# EAGLE board bmsf3 (EAGLE 4.13), part 1 of 2
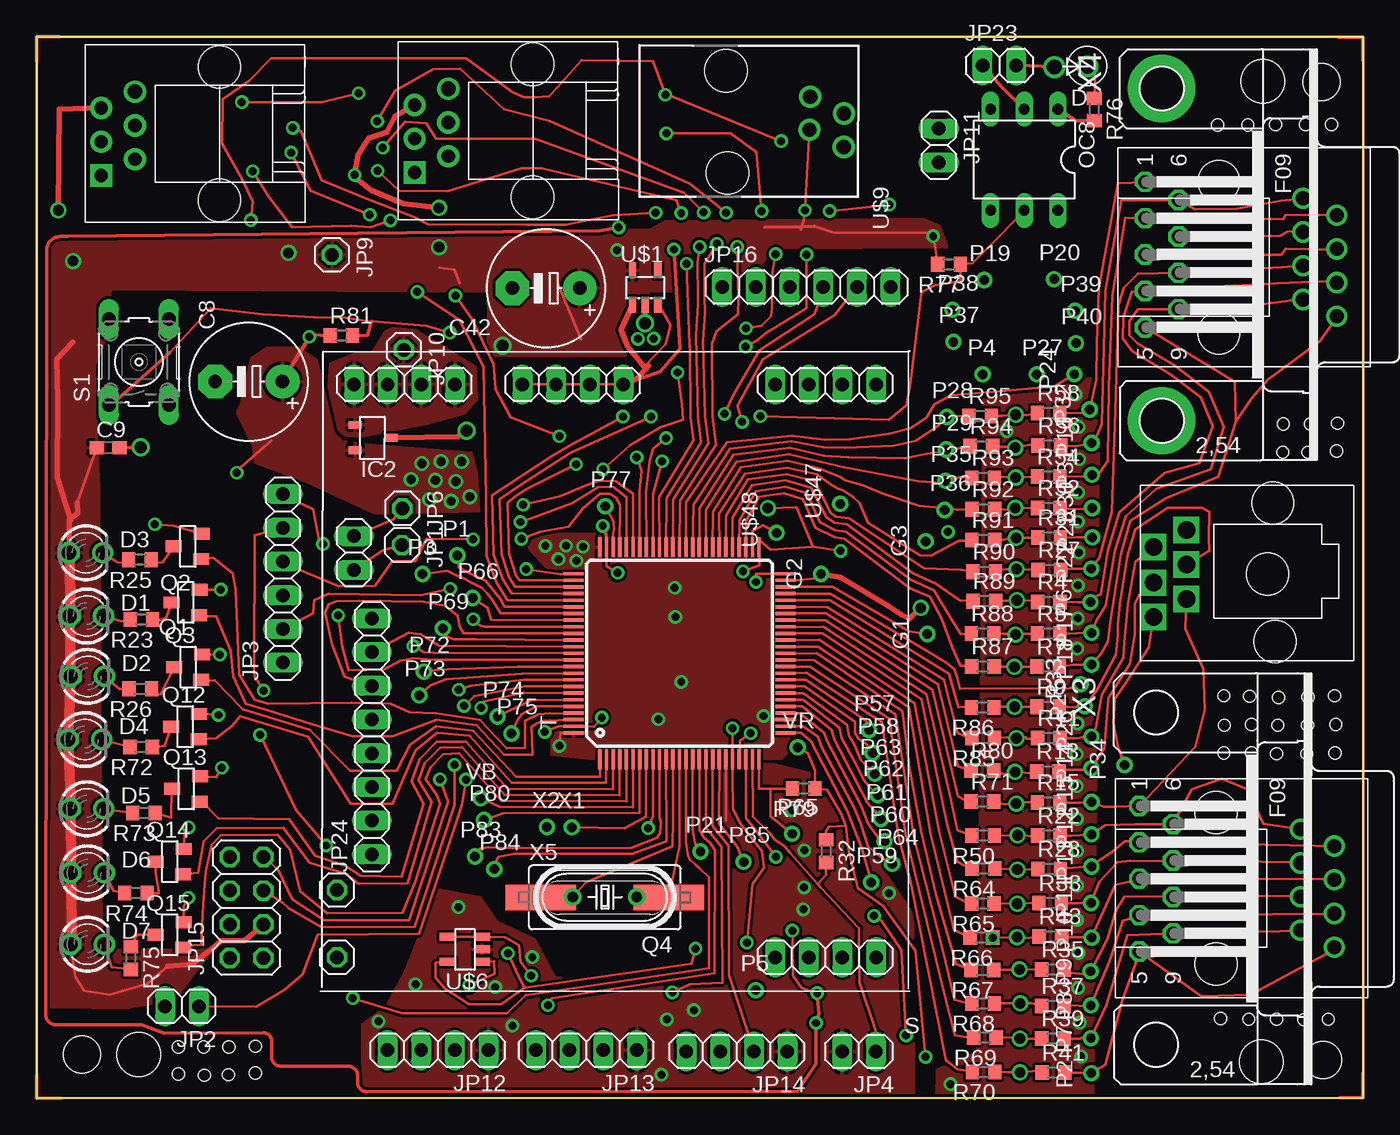
[diagram p2: board, top side]
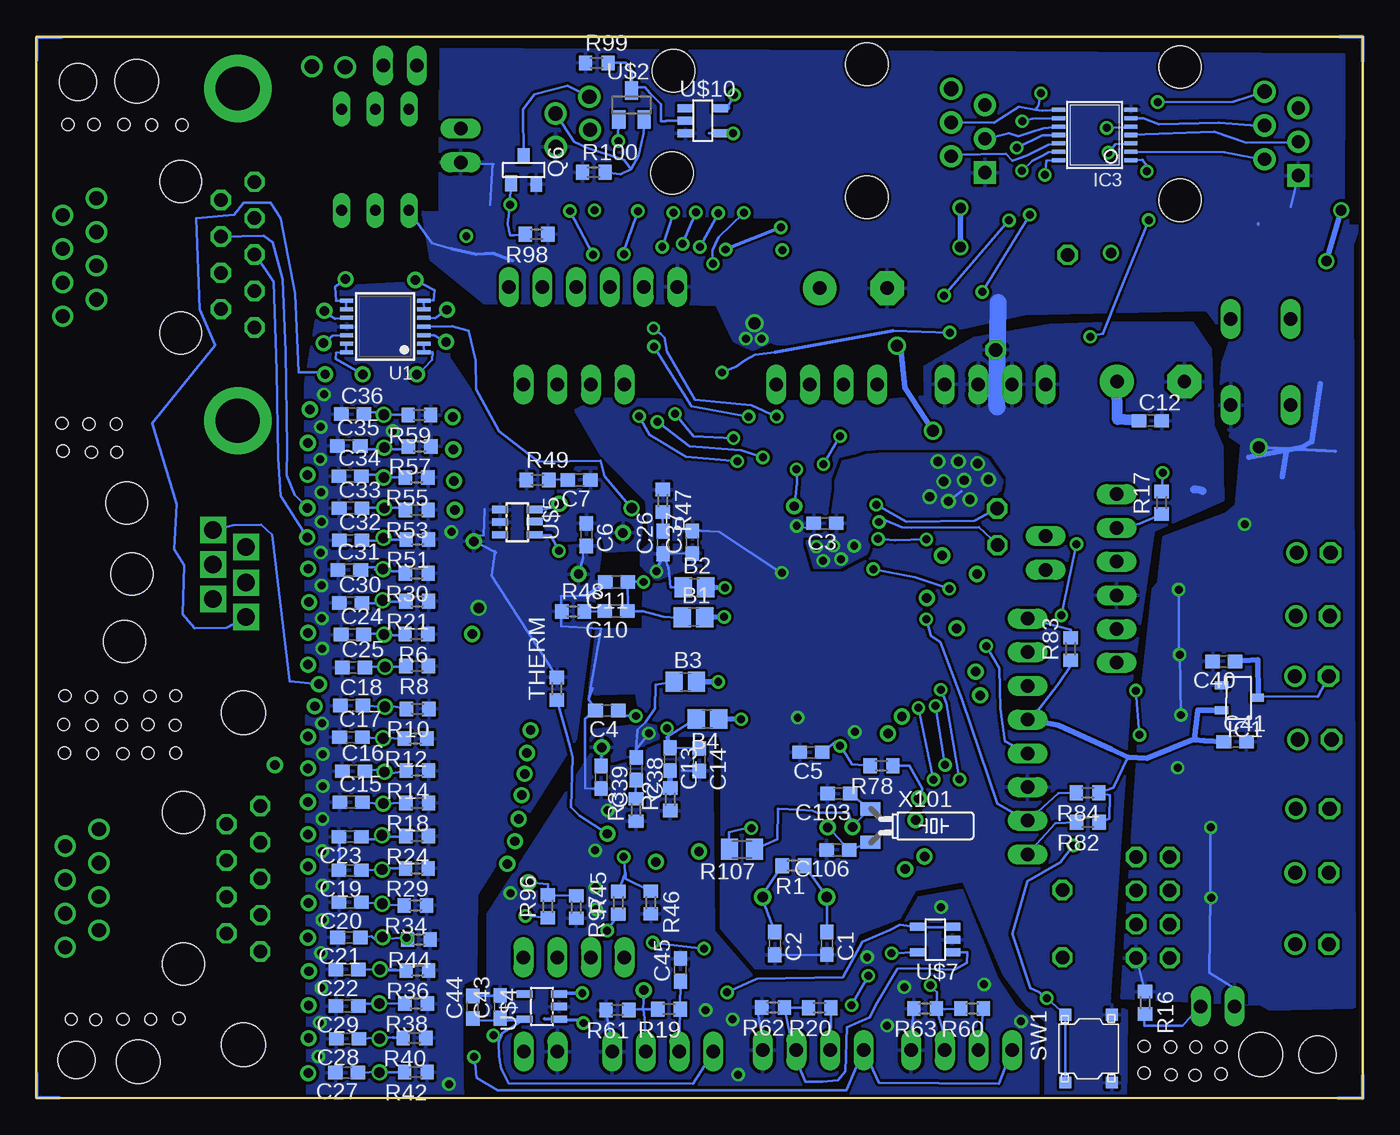
[diagram p3: board, bottom side, seen from below]

Size 100.02 x 80 mm. Coordinates in mm from the lower left corner, seen from the top.
Outline: 99.97,79.98 0.01,80 0,0 100,0.01
Outline: 100.02,79.97 100.02,0.03
Copper layers (1*16): Top 0.035mm / dielectric 1.5mm / Bottom 0.035mm
Design rules "default": minimum track width 8mil, minimum drill 0.6mm, track to track 0.2083mm, track to pad 8mil, pad to pad 8mil, via to via 8mil, smd to smd 0mil, copper to edge 8mil, drill to drill 8mil, minimum pad ring 10mil, minimum via ring 8mil, stop-mask expansion 4mil, vias tented up to drill 0mil, thermal gap 10mil
Holes 2.8 mm at 96.89,76.57 97,2.87 3.43,3.3
Holes 3.2 mm at 92.81,39.5
Holes 3.3 mm at 92.47,76.64 92.34,2.75 7.69,3.29
Holes 0.9 mm at 89.03,73.34 91.31,73.34 93.41,73.38 95.67,73.38 97.62,73.38 89.28,5.99 91.41,5.94 93.5,5.94 95.53,5.9 97.39,5.94 89.5,26.01 91.59,26.01 93.5,25.96 95.78,25.96 97.91,26.01 89.55,28.1 91.59,28.15 93.58,28.1 95.81,28.1 97.95,28.15 89.5,30.33 91.45,30.28 93.64,30.19 95.86,30.24 97.86,30.33 98.09,50.86 96.06,50.81 94,50.81 93.97,48.67 95.86,48.67 98,48.77 16.5,1.9 16.5,3.9 14.51,3.85 12.6,3.85 14.46,1.76 12.65,1.72 10.7,3.85 10.7,1.81

## Footprints (pad centres in the part's own frame; a part is rotated, then mirrored left to right if it is on the bottom)
C0805 = smd 1.3 x 1.5: 1 -0.85,0; 2 0.85,0
C0603 = smd 1.1 x 1: 1 -0.85,0; 2 0.85,0
E5-8,5 = drill 1.016 pad 2.54 round: + -2.54,0 | drill 1.016 pad 2.54 octagon: - 2.54,0
DO41-10_VERT = drill 1.1 round: A 2.58,0.05; C 0.07,0
LED3 = drill 1.067 pad 1.6 octagon: A -1.27,0 | drill 1.067 pad 1.6 round: K 1.27,0
SOLPAD028 = drill 0.711 pad 1.016 round: MP 0,0
SOT-23A = smd 0.6 x 1: P$1 -0.95,-1.35; P$2 0.95,-1.35; P$3 0,1.35
TSSOP14 = smd 0.305 x 0.991: 1 -1.905,-2.718; 2 -1.27,-2.718; 3 -0.635,-2.718; 4 0,-2.718; 5 0.635,-2.718; 6 1.27,-2.718; 7 1.905,-2.718; 8 1.905,2.718; 9 1.27,2.718; 10 0.635,2.718; 11 0,2.718; 12 -0.635,2.718; 13 -1.27,2.718; 14 -1.905,2.718
1X01 = drill 1.016 octagon: 1 0,0
1X02 = drill 1.016 long: 1 -1.27,0; 2 1.27,0
1X06 = drill 1.016 long: 1 -6.35,0; 2 -3.81,0; 3 -1.27,0; 4 1.27,0; 5 3.81,0; 6 6.35,0
MOD8P8C = drill 1.067 pad 1.397 round: 1 -3.81,-2.54; 2 -2.54,0; 3 -1.27,-2.54; 4 0,0; 5 1.27,-2.54; 6 2.54,0; 7 3.81,-2.54; 8 5.08,0 | hole 3.175: -5.08,-8.89; 6.35,-8.89
1X04 = drill 1.016 long: 1 -3.81,0; 2 -1.27,0; 3 1.27,0; 4 3.81,0
2X04 = drill 1.016 octagon: 1 -3.81,-1.27; 2 -3.81,1.27; 3 -1.27,-1.27; 4 -1.27,1.27; 5 1.27,-1.27; 6 1.27,1.27; 7 3.81,-1.27; 8 3.81,1.27
1X08 = drill 1.016 long: 1 -8.89,0; 2 -6.35,0; 3 -3.81,0; 4 -1.27,0; 5 1.27,0; 6 3.81,0; 7 6.35,0; 8 8.89,0
MOD6P6C_VERT = drill 1.321 pad 1.778 square: 1 -2.694,0; 2 -1.324,-2.486; 3 -0.1,0; 4 1.27,-2.486; 5 2.594,0; 6 3.864,-2.486 | hole 3.175: -4.537,-9.154; 5.907,-9
DIL06 = drill 0.813 long: 1 -2.54,-3.81; 2 0,-3.81; 3 2.54,-3.81; 4 2.54,3.81; 5 0,3.81; 6 -2.54,3.81
SOT-23 = smd 0.9 x 1.2: 1 -1,-1.006; 2 0.9,-1.056; 3 -0.05,1.056
HC49U-V = drill 0.8 round: 1 -2.413,0; 2 2.413,0
R0603 = smd 1 x 1.1: 1 -0.85,0; 2 0.85,0
M0805 = smd 1.3 x 1.6: 1 -0.95,0; 2 0.95,0
SUBBRD1B = drill 1.016 long: 1 2.54,2.54; 2 5.08,2.54; 3 7.62,2.54; 4 10.16,2.54; 5 21.59,2.54; 6 24.13,2.54; 7 26.67,2.54; 8 29.21,2.54; 9 34.29,2.54; 10 36.83,2.54; 11 39.37,2.54; 12 41.91,2.54; 13 2.54,45.72; 14 5.08,45.72; 15 7.62,45.72; 16 10.16,45.72; 17 41.91,13.97; 18 41.91,16.51 | drill 1.016 octagon: 19 43.18,45.72; 20 43.18,40.64
B3F-10XX = drill 1.016 long: 1 -3.251,2.261; 2 3.251,2.261; 3 -3.251,-2.261; 4 3.251,-2.261
E-SWITCH = smd 0.9 x 0.9: P$1 -2.55,1.75; P$2 2.55,1.75; P$3 -2.55,-1.75; P$4 2.55,-1.75
TQFP100_NARROW = smd 1.5 x 0.25: 1 -8,6; 2 -8,5.5; 3 -8,5; 4 -8,4.5; 5 -8,4; 6 -8,3.5; 7 -8,3; 8 -8,2.5; 9 -8,2; 10 -8,1.5; 11 -8,1; 12 -8,0.5; 13 -8,0; 14 -8,-0.5; 15 -8,-1; 16 -8,-1.5; 17 -8,-2; 18 -8,-2.5; 19 -8,-3; 20 -8,-3.5; 21 -8,-4; 22 -8,-4.5; 23 -8,-5; 24 -8,-5.5; 25 -8,-6; 51 8,-6; 52 8,-5.5; 53 8,-5; 54 8,-4.5; 55 8,-4; 56 8,-3.5; 57 8,-3; 58 8,-2.5; 59 8,-2; 60 8,-1.5; 61 8,-1; 62 8,-0.5; 63 8,0; 64 8,0.5; 65 8,1; 66 8,1.5; 67 8,2; 68 8,2.5; 69 8,3; 70 8,3.5; 71 8,4; 72 8,4.5; 73 8,5; 74 8,5.5; 75 8,6 | smd 0.25 x 1.5: 26 -6,-8; 27 -5.5,-8; 28 -5,-8; 29 -4.5,-8; 30 -4,-8; 31 -3.5,-8; 32 -3,-8; 33 -2.5,-8; 34 -2,-8; 35 -1.5,-8; 36 -1,-8; 37 -0.5,-8; 38 0,-8; 39 0.5,-8; 40 1,-8; 41 1.5,-8; 42 2,-8; 43 2.5,-8; 44 3,-8; 45 3.5,-8; 46 4,-8; 47 4.5,-8; 48 5,-8; 49 5.5,-8; 50 6,-8; 76 6,8; 77 5.5,8; 78 5,8; 79 4.5,8; 80 4,8; 81 3.5,8; 82 3,8; 83 2.5,8; 84 2,8; 85 1.5,8; 86 1,8; 87 0.5,8; 88 0,8; 89 -0.5,8; 90 -1,8; 91 -1.5,8; 92 -2,8; 93 -2.5,8; 94 -3,8; 95 -3.5,8; 96 -4,8; 97 -4.5,8; 98 -5,8; 99 -5.5,8; 100 -6,8
TSSOP14' = smd 0.305 x 0.991: 1 -1.95,-2.918; 2 -1.3,-2.918; 3 -0.65,-2.918; 4 0,-2.918; 5 0.65,-2.918; 6 1.3,-2.918; 7 1.95,-2.918; 8 1.95,2.918; 9 1.3,2.918; 10 0.65,2.918; 11 0,2.918; 12 -0.65,2.918; 13 -1.3,2.918; 14 -1.95,2.918
SOT-25 = smd 0.55 x 1.2: 1 -0.95,-1.3; 2 0,-1.3; 3 0.95,-1.3; 4 0.95,1.3; 5 -0.95,1.3
SOT23 = smd 1 x 1.4: 1 -0.95,-1.1; 2 0.95,-1.1; 3 0,1.1
SOT23-6 = smd 0.55 x 1.2: 1 -0.95,-1.3; 2 0,-1.3; 3 0.95,-1.3; 4 0.95,1.3; 5 -0.05,1.3; 6 -0.95,1.3
SOT23-5 = smd 0.6 x 1.2: 1 -0.95,-1.306; 2 0,-1.306; 3 0.95,-1.306; 4 0.95,1.306; 5 -0.95,1.306
MOD6P6C_1 = drill 1 pad 1.676 square: 1 -3.175,8.898 | drill 1 pad 1.676 round: 2 -1.951,6.358; 3 -0.627,8.898; 4 0.597,6.358; 5 1.921,8.898 | drill 1.1 pad 1.676 round: 6 3.145,6.358 | hole 3.2: -5.029,-0.01; 4.999,-0.01
MOD4P4C_VERT = drill 1.067 pad 1.676 round: 1 1.89,8.86; 2 0.59,6.28; 3 -0.63,8.88; 4 -1.89,6.33 | hole 3.2: -3.85,-0.01; 3.86,0.1
SOT-23' = smd 0.6 x 1.2: 1 -0.95,-1.306; 2 0,-1.306; 3 0.95,-1.306; 4 0.95,1.306; 5 -0.95,1.306
F09H = drill 1.016 octagon: 1 -5.486,-1.27; 2 -2.743,-1.27; 3 0,-1.27; 4 2.743,-1.27; 5 5.486,-1.27; 6 -4.115,1.27; 7 -1.372,1.27; 8 1.372,1.27; 9 4.115,1.27 | hole 3.302: -12.522,0; 12.522,0
F09HP = drill 1.016 octagon: 1 -5.486,-1.27; 2 -2.743,-1.27; 3 0,-1.27; 4 2.743,-1.27; 5 5.486,-1.27; 6 -4.115,1.27; 7 -1.372,1.27; 8 1.372,1.27; 9 4.115,1.27 | drill 3.302 pad 5.08 round: G1 -12.522,0; G2 12.522,0
HC49UP = smd 5.334 x 1.93: 1 -4.826,0; 2 4.826,0
TC26H_SMD = smd 1 x 1.5: P$1 -1.29,-0.12; P$2 1.21,-0.12

## Placement (x,y rotation side)
B1  L-BEAD  [C0805]  50.47,36.25 0 bottom
B2  L-BEAD  [C0805]  50.39,38.5 0 bottom
B3  L-BEAD  [C0805]  51.09,31.38 0 bottom
B4  L-BEAD  [C0805]  49.41,28.57 180 bottom
C1  15p  [C0603]  40.41,11.66 270 bottom
C2  15p  [C0603]  44.34,11.65 270 bottom
C3  100n  [C0603]  40.56,43.32 180 bottom
C4  100n  [C0603]  57.01,29.21 180 bottom
C5  100n  [C0603]  41.61,26.06 180 bottom
C6  10n  [C0603]  58.55,42.47 270 bottom
C7  1u  [C0603]  59.09,46.59 180 bottom
C8  100m@50v  [E5-8,5]  16,54.01 180 top
C9  0.1  [C0603]  5.4,49.01 0 top
C10  1u  [C0603]  56.3,36.71 180 bottom
C11  10n  [C0603]  56.28,38.9 180 bottom
C12  100n  [C0603]  16.02,51.05 0 bottom
C13  1u  [C0603]  52.23,25.55 270 bottom
C14  10n  [C0603]  50.04,25.5 270 bottom
C15  0.1U  [C0603]  76.29,22.3 0 bottom
C16  0.1U  [C0603]  76.11,24.64 0 bottom
C17  0.1U  [C0603]  76.3,27.19 0 bottom
C18  0.1U  [C0603]  76.24,29.59 0 bottom
C19  0.1U  [C0603]  76.37,17.18 180 bottom
C20  0.1U  [C0603]  76.35,14.76 180 bottom
C21  0.1U  [C0603]  76.45,12.11 180 bottom
C22  0.1U  [C0603]  76.59,9.7 180 bottom
C23  0.1U  [C0603]  76.37,19.7 180 bottom
C24  0.1U  [C0603]  76.19,34.94 0 bottom
C25  0.1U  [C0603]  76.11,32.45 0 bottom
C26  1u  [C0603]  52.77,41.88 90 bottom
C27  0.1U  [C0603]  76.62,1.92 180 bottom
C28  0.1U  [C0603]  76.56,4.48 180 bottom
C29  0.1U  [C0603]  76.58,6.94 180 bottom
C30  0.1U  [C0603]  76.32,37.33 0 bottom
C31  0.1U  [C0603]  76.42,39.8 0 bottom
C32  0.1U  [C0603]  76.31,42.05 0 bottom
C33  0.1U  [C0603]  76.34,44.47 0 bottom
C34  0.1U  [C0603]  76.36,46.88 0 bottom
C35  0.1U  [C0603]  76.46,49.16 0 bottom
C36  0.1U  [C0603]  76.16,51.55 0 bottom
C37  10n  [C0603]  50.56,41.9 90 bottom
C38  1u  [C0603]  54.79,24.82 270 bottom
C39  10n  [C0603]  57.44,24.18 270 bottom
C40  100n  [C0603]  10.49,32.91 180 bottom
C41  100n  [C0603]  9.63,26.85 0 bottom
C42  100m@50v  [E5-8,5]  38.41,61.04 180 top
C43  100n  [C0603]  65.06,6.87 90 bottom
C44  10u  [C0603]  67.11,6.85 90 bottom
C45  1u  [C0603]  51.45,9.66 90 bottom
C103  10p  [C0603]  39.52,22.95 180 bottom
C106  10p  [C0603]  39.59,18.7 180 bottom
D  1N4004_VERT  [DO41-10_VERT]  79.31,77.75 180 top
D1  LED3  [LED3]  3.78,36.34 0 top
D2  LED3  [LED3]  3.85,31.79 0 top
D3  LED3  [LED3]  3.72,41.1 0 top
D4  LED3  [LED3]  3.64,27.02 0 top
D5  LED3  [LED3]  3.79,21.8 0 top
D6  LED3  [LED3]  3.84,16.98 0 top
D7  LED3  [LED3]  3.84,11.6 0 top
G1  SOLDPAD028  [SOLPAD028]  67.16,34.98 90 top
G2  SOLDPAD028  [SOLPAD028]  59.14,39.5 90 top
G3  SOLDPAD028  [SOLPAD028]  67.03,41.97 90 top
IC1  AP7333  [SOT-23A]  9.32,30.18 270 bottom
IC2  AP7333  [SOT-23A]  25.37,49.78 270 top
IC3  MC74VHCT50A  [TSSOP14]  20.23,72.59 90 bottom
JP1  [1X01]  27.55,41.67 270 top
JP2  [1X02]  10.96,6.92 180 top
JP3  [1X06]  18.57,39.16 90 top
JP4  [1X02]  62.01,3.51 180 top
JP6  [1X01]  27.57,44.44 270 top
JP7  [MOD8P8C]  98.03,64 270 top
JP8  [MOD8P8C]  97.83,16.45 270 top
JP9  [1X01]  22.27,63.55 270 top
JP10  [1X01]  27.69,56.4 270 top
JP11  [1X02]  68.03,71.8 270 top
JP12  [1X04]  30.26,3.61 180 top
JP13  [1X04]  41.45,3.61 180 top
JP14  [1X04]  52.8,3.51 180 top
JP15  [2X04]  15.84,14.37 90 top
JP16  [1X06]  58.05,61.14 0 top
JP23  [1X02]  72.59,77.83 0 top
JP24  [1X08]  25.29,27.25 90 top
MOD  MOD6P6C_V  [MOD6P6C_VERT]  84.2,38.95 90 top
OC8  LTV-816  [DIL06]  74.47,70.72 180 top
P1  SOLDPAD028  [SOLPAD028]  31.73,40.9 0 top
P2  SOLDPAD028  [SOLPAD028]  79.52,1.88 90 top
P3  SOLDPAD028  [SOLPAD028]  29.09,39.5 0 top
P4  SOLDPAD028  [SOLPAD028]  71.33,54.55 0 top
P5  SOLDPAD028  [SOLPAD028]  54.22,8.14 0 top
P6  SOLDPAD028  [SOLPAD028]  79.46,37.38 90 top
P7  SOLDPAD028  [SOLPAD028]  79.49,4.52 90 top
P8  SOLDPAD028  [SOLPAD028]  79.49,6.99 90 top
P9  SOLDPAD028  [SOLPAD028]  79.47,9.56 90 top
P10  SOLDPAD028  [SOLPAD028]  79.54,12.09 90 top
P11  SOLDPAD028  [SOLPAD028]  79.5,14.71 90 top
P12  SOLDPAD028  [SOLPAD028]  79.53,19.88 90 top
P13  SOLDPAD028  [SOLPAD028]  79.53,17.46 90 top
P14  SOLDPAD028  [SOLPAD028]  79.53,24.85 90 top
P15  SOLDPAD028  [SOLPAD028]  79.54,22.32 90 top
P16  SOLDPAD028  [SOLPAD028]  79.55,49.38 90 top
P17  SOLDPAD028  [SOLPAD028]  79.53,35.06 90 top
P18  SOLDPAD028  [SOLPAD028]  79.53,32.66 90 top
P19  SOLDPAD028  [SOLPAD028]  71.45,61.66 0 top
P20  SOLDPAD028  [SOLPAD028]  76.7,61.72 0 top
P21  SOLDPAD028  [SOLPAD028]  50.05,18.59 0 top
P22  SOLDPAD028  [SOLPAD028]  79.52,39.9 90 top
P23  SOLDPAD028  [SOLPAD028]  79.59,42.27 90 top
P24  SOLDPAD028  [SOLPAD028]  78.25,54.55 90 top
P25  SOLDPAD028  [SOLPAD028]  79.03,29.54 90 top
P26  SOLDPAD028  [SOLPAD028]  79.53,27.24 90 top
P27  SOLDPAD028  [SOLPAD028]  75.42,54.55 0 top
P28  SOLDPAD028  [SOLPAD028]  68.62,51.33 0 top
P29  SOLDPAD028  [SOLPAD028]  68.58,48.88 0 top
P30  SOLDPAD028  [SOLPAD028]  79.58,44.48 90 top
P31  SOLDPAD028  [SOLPAD028]  79.57,46.98 90 top
P32  SOLDPAD028  [SOLPAD028]  79.4,51.91 90 top
P33  SOLDPAD028  [SOLPAD028]  78.71,31.2 90 top
P34  SOLDPAD028  [SOLPAD028]  82.03,25.11 90 top
P35  SOLDPAD028  [SOLPAD028]  68.53,46.52 0 top
P36  SOLDPAD028  [SOLPAD028]  68.47,44.33 0 top
P37  SOLDPAD028  [SOLPAD028]  69.12,57 0 top
P38  SOLDPAD028  [SOLPAD028]  69.06,59.42 0 top
P39  SOLDPAD028  [SOLPAD028]  78.31,59.34 0 top
P40  SOLDPAD028  [SOLPAD028]  78.36,56.9 0 top
P57  SOLDPAD028  [SOLPAD028]  62.76,27.73 0 top
P58  SOLDPAD028  [SOLPAD028]  63.03,26.01 0 top
P59  SOLDPAD028  [SOLPAD028]  62.92,16.27 0 top
P60  SOLDPAD028  [SOLPAD028]  63.94,19.36 0 top
P61  SOLDPAD028  [SOLPAD028]  63.66,21.04 0 top
P62  SOLDPAD028  [SOLPAD028]  63.43,22.84 0 top
P63  SOLDPAD028  [SOLPAD028]  63.2,24.43 0 top
P64  SOLDPAD028  [SOLPAD028]  64.5,17.66 0 top
P65  SOLDPAD028  [SOLPAD028]  56.97,19.93 0 top
P66  SOLDPAD028  [SOLPAD028]  32.88,37.69 0 top
P69  SOLDPAD028  [SOLPAD028]  30.63,35.41 0 top
P72  SOLDPAD028  [SOLPAD028]  29.2,32.15 0 top
P73  SOLDPAD028  [SOLPAD028]  28.86,30.36 0 top
P74  SOLDPAD028  [SOLPAD028]  34.76,28.76 0 top
P75  SOLDPAD028  [SOLPAD028]  35.8,27.48 0 top
P77  SOLDPAD028  [SOLPAD028]  42.88,44.61 0 top
P80  SOLDPAD028  [SOLPAD028]  33.73,20.96 0 top
P83  SOLDPAD028  [SOLPAD028]  33.05,18.21 0 top
P84  SOLDPAD028  [SOLPAD028]  34.51,17.26 0 top
P85  SOLDPAD028  [SOLPAD028]  53.3,17.81 0 top
Q1  IRLML2060  [SOT-23]  11.26,37.41 90 top
Q2  IRLML2060  [SOT-23]  11.4,41.63 90 top
Q3  IRLML2060  [SOT-23]  11.42,32.53 90 top
Q4  [HC49U-V]  42.85,15.14 180 top
Q6  IRLML2060  [SOT-23]  63.23,69.95 0 bottom
Q12  IRLML2060  [SOT-23]  11.21,28.05 90 top
Q13  IRLML2060  [SOT-23]  11.29,23.35 90 top
Q14  IRLML2060  [SOT-23]  10.04,17.88 90 top
Q15  IRLML2060  [SOT-23]  10.04,12.35 90 top
R1  470K  [R0603]  42.94,17.52 180 bottom
R2  3.9  [R0603]  52.23,22.52 90 bottom
R3  3.9  [R0603]  54.8,21.72 90 bottom
R4  680K  [R0603]  76.33,37.41 0 top
R5  680K  [R0603]  76.3,35.01 0 top
R6  45.9K  [R0603]  71.36,34.97 180 bottom
R7  680K  [R0603]  76.27,32.52 0 top
R8  45.9K  [R0603]  71.31,32.56 180 bottom
R9  680K  [R0603]  76.27,29.5 0 top
R10  45.9K  [R0603]  71.27,29.34 180 bottom
R11  680K  [R0603]  76.32,27.14 0 top
R12  45.9K  [R0603]  71.42,27.09 180 bottom
R13  680K  [R0603]  76.24,24.63 0 top
R14  45.9K  [R0603]  71.29,24.68 180 bottom
R15  680K  [R0603]  76.3,22.29 0 top
R16  10K  [R0603]  16.42,7.18 270 bottom
R17  10K  [R0603]  15.17,44.87 90 bottom
R18  45.9K  [R0603]  71.3,22.25 180 bottom
R19  3.6K  [R0603]  52.32,6.7 180 bottom
R20  10K  [R0603]  40.96,6.81 180 bottom
R21  45.9K  [R0603]  71.3,37.45 180 bottom
R22  680K  [R0603]  76.32,19.78 0 top
R23  330  [R0603]  7.91,36.08 180 top
R24  45.9K  [R0603]  71.31,19.74 180 bottom
R25  330  [R0603]  7.8,40.58 180 top
R26  330  [R0603]  7.82,30.85 180 top
R27  680K  [R0603]  76.36,39.81 0 top
R28  680K  [R0603]  76.34,17.27 0 top
R29  45.9K  [R0603]  71.33,17.31 180 bottom
R30  45.9K  [R0603]  71.34,39.55 180 bottom
R31  680K  [R0603]  76.34,42.24 0 top
R32  10K  [R0603]  59.54,18.61 270 top
R33  680K  [R0603]  76.42,14.7 0 top
R34  45.9K  [R0603]  71.44,14.52 180 bottom
R35  680K  [R0603]  76.62,9.69 0 top
R36  45.9K  [R0603]  71.29,9.62 180 bottom
R37  680K  [R0603]  76.62,6.94 0 top
R38  45.9K  [R0603]  71.38,7.13 180 bottom
R39  680K  [R0603]  76.63,4.49 0 top
R40  45.9K  [R0603]  71.51,4.53 180 bottom
R41  680K  [R0603]  76.66,1.92 0 top
R42  45.9K  [R0603]  71.41,1.96 180 bottom
R43  680K  [R0603]  76.43,12.19 0 top
R44  45.9K  [R0603]  71.18,11.94 180 bottom
R45  4.7K  [R0603]  56.13,14.71 90 bottom
R46  1K  [R0603]  53.69,14.74 270 bottom
R47  3.9  [R0603]  52.79,45.02 270 bottom
R48  3.9  [R0603]  59.55,36.68 0 bottom
R49  3.9  [R0603]  62.23,46.59 0 bottom
R50  900  [R0603]  71.36,19.78 180 top
R51  45.9K  [R0603]  71.29,42.12 180 bottom
R52  680K  [R0603]  76.32,44.48 0 top
R53  45.9K  [R0603]  71.34,44.34 180 bottom
R54  680K  [R0603]  76.3,46.84 0 top
R55  45.9K  [R0603]  71.35,46.78 180 bottom
R56  680K  [R0603]  76.35,49.17 0 top
R57  45.9K  [R0603]  71.12,49.12 180 bottom
R58  680K  [R0603]  76.31,51.63 0 top
R59  45.9K  [R0603]  71.14,51.48 180 bottom
R60  10K  [R0603]  29.46,6.75 180 bottom
R61  6.4K  [R0603]  56.21,6.64 180 bottom
R62  10K  [R0603]  44.47,6.84 180 bottom
R63  10K  [R0603]  33.01,6.75 180 bottom
R64  900  [R0603]  71.39,17.31 180 top
R65  900  [R0603]  71.36,14.66 180 top
R66  900  [R0603]  71.23,12.1 180 top
R67  900  [R0603]  71.31,9.67 180 top
R68  900  [R0603]  71.36,7.14 180 top
R69  900  [R0603]  71.5,4.57 180 top
R70  900  [R0603]  71.41,1.98 180 top
R71  900  [R0603]  71.31,22.34 0 top
R72  330  [R0603]  7.89,26.48 180 top
R73  330  [R0603]  8.09,21.5 180 top
R74  330  [R0603]  7.49,15.45 180 top
R75  330  [R0603]  7.11,10.55 270 top
R76  68K  [R0603]  79.75,74.52 270 top
R77  10K  [R0603]  68.8,62.84 180 top
R78  zero  [R0603]  36.29,25.05 180 bottom
R79  10K  [R0603]  57.84,23.32 180 top
R80  900  [R0603]  71.31,24.68 0 top
R81  10K  [R0603]  22.98,57.47 0 top
R82  10K  [R0603]  20.73,20.79 180 bottom
R83  10K  [R0603]  22.05,33.85 90 bottom
R84  10K  [R0603]  20.75,23.02 180 bottom
R85  900  [R0603]  71.36,27.14 180 top
R86  900  [R0603]  71.33,29.45 180 top
R87  900  [R0603]  71.34,32.54 0 top
R88  900  [R0603]  71.33,35.01 0 top
R89  900  [R0603]  71.45,37.45 0 top
R90  900  [R0603]  71.45,39.67 0 top
R91  900  [R0603]  71.38,42.06 0 top
R92  900  [R0603]  71.39,44.38 0 top
R93  900  [R0603]  71.36,46.75 0 top
R94  900  [R0603]  71.23,49.13 0 top
R95  900  [R0603]  71.14,51.41 0 top
R96  1K  [R0603]  61.45,14.45 90 bottom
R97  1.8K  [R0603]  59.31,14.4 270 bottom
R98  470K  [R0603]  62.3,65.11 180 bottom
R99  3.3K  [R0603]  57.77,78.02 0 bottom
R100  10K  [R0603]  57.99,69.78 0 bottom
R107  330  [M0805]  46.81,18.75 180 bottom
S  SUBBRD1A  [SUBBRD1B]  65.83,56.33 180 top
S1  [B3F-10XX]  7.71,55.48 90 top
SW1  E-SWITCH  [E-SWITCH]  20.69,3.73 90 bottom
T  [TQFP100_NARROW]  48.47,33.52 90 top
THERM  10K  [R0603]  60.77,30.86 90 bottom
U1  MCP6L04  [TSSOP14']  73.72,58.15 90 bottom
U$1  AP2204K  [SOT-25]  45.88,61.08 0 top
U$2  2SA1298  [SOT23]  55.15,74.85 0 bottom
U$4  AP2204K  [SOT-25]  61.9,6.9 90 bottom
U$5  LT6656XXS6  [SOT23-6]  63.77,43.41 270 bottom
U$6  MCP6L01UT  [SOT23-5]  32.3,11.21 90 top
U$7  MCP6L01UT  [SOT23-5]  32.24,11.95 90 bottom
U$8  MOD6P6C_1  [MOD6P6C_1]  13.78,72.71 90 top
U$9  4P4C_VERT  [MOD4P4C_VERT]  51.99,73.58 270 top
U$10  74S14  [SOT-23']  49.77,73.67 270 bottom
U$15  MOD6P6C_1  [MOD6P6C_1]  37.4,72.93 90 top
U$47  SOLDPAD028  [SOLPAD028]  60.59,44.78 90 top
U$48  SOLDPAD028  [SOLPAD028]  55.79,42.6 90 top
VB  SOLDPAD028  [SOLPAD028]  33.48,22.59 0 top
VR  SOLDPAD028  [SOLPAD028]  57.38,26.43 0 top
X1  SOLDPAD028  [SOLPAD028]  40.36,20.41 0 top
X2  SOLDPAD028  [SOLPAD028]  38.48,20.43 0 top
X3  [F09H]  84.41,16.54 270 top
X4  [F09HP]  84.83,63.58 270 top
X5  10 MHZ  [HC49UP]  42.84,15.12 0 top
X101  32768  [TC26H_SMD]  37.02,20.5 270 bottom